# EAGLE design LightingUPS-Sensor_v1-1 (EAGLE 7.6.0)
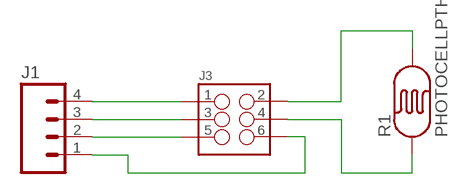
[diagram p0: schematic, sheet 1]

## Parts
J1  M04PTH  [1X04]
J3  M03X2SHROUD  [2X3-SHROUDED]
R1  PHOTOCELLPTH  [PHOTOCELL]

## Nets
N$1: J3.4 R1.1
N$2: J3.2 R1.2
N$5: J1.4 J3.1
N$6: J1.3 J3.3
N$7: J1.2 J3.5
N$8: J1.1 J3.6

## Library data of the parts
J1 = SparkFun-Connectors:M04: Header 4 Standard 4-pin 0.1" header. Use with straight break away headers (SKU : PRT-00116), right angle break away headers (PRT-00553), swiss pins (PRT-00743), machine pins (PRT-00117), and female headers (PRT-00115). Molex polarized connector foot print use with SKU : PRT-08231 with associated crimp pins and housings. 1MM SMD Version SKU: PRT-10208; PROD_ID: CONN-09696
J3 = SparkFun-Connectors:M03X2: 2x3 .1" header. Shrouded, with keying- CONN-10681 SMT- CONN-11415 Pogo pins- HW-11044; PROD_ID: CONN-10681
R1 = SparkFun-Sensors:PHOTOCELL: CdS photoresistor. This is a low cost way to detect light levels. Resistance decreases with more incoming light. SparkFun SKU: SEN-09088

## Board
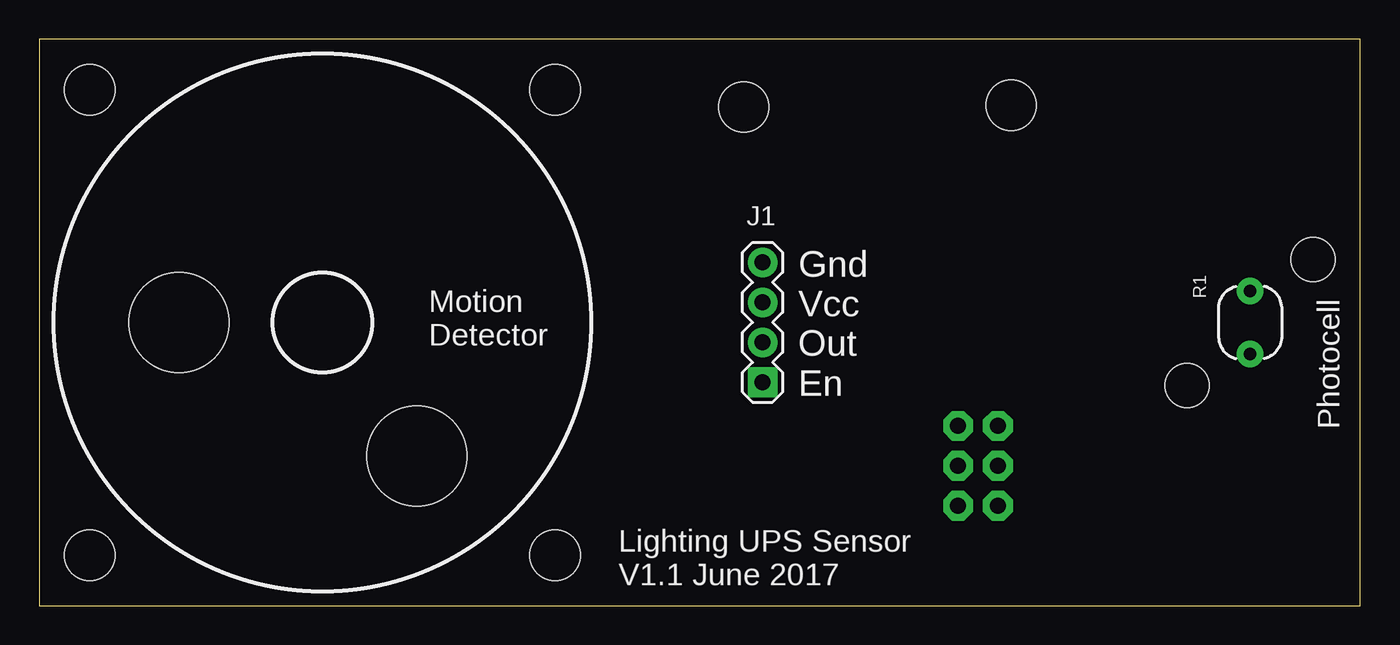
[diagram p1: board, top side]
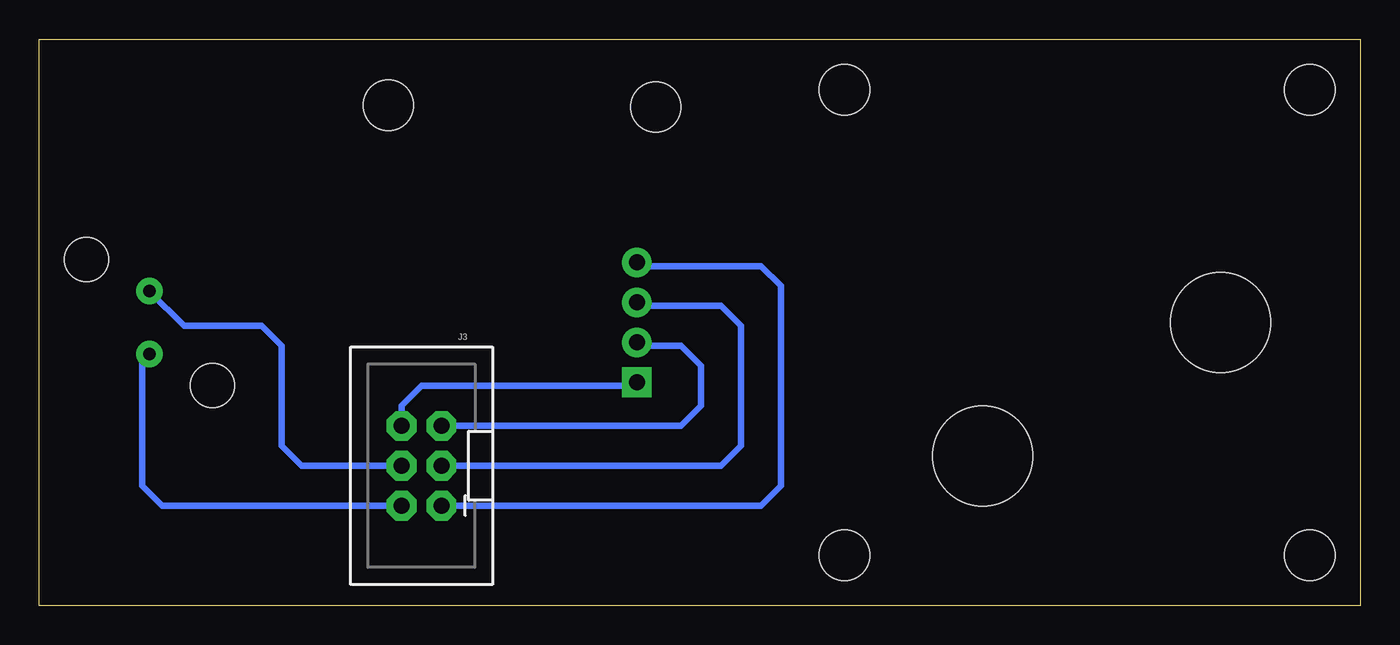
[diagram p2: board, bottom side, seen from below]

Size 84 x 36 mm. Coordinates in mm from the lower left corner, seen from the top.
Outline: 0,0 84,0 84,36 0,36 0,0
Copper layers (1*16): Top 0.035mm / dielectric 1.5mm / Bottom 0.035mm
Design rules "SeeedStudio_2layer_DRU_no_angle_20140221": minimum track width 6mil, minimum drill 12mil, track to track 6mil, track to pad 6mil, pad to pad 6mil, via to via 6mil, smd to smd 0mil, copper to edge 10mil, drill to drill 10mil, minimum pad ring 10mil, minimum via ring 6mil, stop-mask expansion 2mil, vias tented up to drill 100mil, thermal gap 10mil
Holes 3.2 mm at 3.2,32.8 3.2,3.2 32.8,3.2 32.8,32.8 44.8,31.7 61.8,31.8
Holes 2.8 mm at 81,22 73,14

### Footprints (pad centres in the part's own frame; a part is rotated, then mirrored left to right if it is on the bottom)
1X04 = drill 1.016 pad 1.88 square: 1 0,0 | drill 1.016 pad 1.88: 2 2.54,0; 3 5.08,0; 4 7.62,0
2X3-SHROUDED = drill 1.016 pad 1.88 octagon: 1 -1.27,2.54; 2 1.27,2.54; 3 -1.27,0; 4 1.27,0; 5 -1.27,-2.54; 6 1.27,-2.54
PHOTOCELL = drill 0.8 pad 1.676: 1 -2,0; 2 2,0
DRILL_0.2500 = hole 6.35: 0,0

### Placement (x,y rotation side)
J1  46,14.2 90 top
J3  59.69,8.89 180 bottom
R1  77,18 270 top
U$1  [DRILL_0.2500]  24,9.53 0 top
U$5  [DRILL_0.2500]  8.89,18 0 top

### Tracks (layer width: path | path; a pad name or v marks a point on that pad's centre or on a via)
N$1
  Bottom 0.406: J3.4 67.31,8.89 68.58,10.16 68.58,16.51 69.85,17.78 74.78,17.78 R1.1
N$2
  Bottom 0.406: J3.2 76.2,6.35 77.47,7.62 77.47,15.53 R1.2
N$5
  Bottom 0.406: J3.1 38.1,6.35 36.83,7.62 36.83,20.32 38.1,21.59 45.77,21.59 J1.4
N$6
  Bottom 0.406: J3.3 40.64,8.89 39.37,10.16 39.37,17.78 40.64,19.05 45.77,19.05 J1.3
N$7
  Bottom 0.406: J3.5 43.18,11.43 41.91,12.7 41.91,15.24 43.18,16.51 45.77,16.51 J1.2
N$8
  Bottom 0.406: J3.6 60.96,12.7 59.69,13.97 46.23,13.97 J1.1

### Text on the board
tPlace: Photocell | Motion / Detector | Gnd / Vcc / Out / En | Lighting UPS Sensor / V1.1 June 2017